# Altium schematic sheet Power.SchDoc
size A3
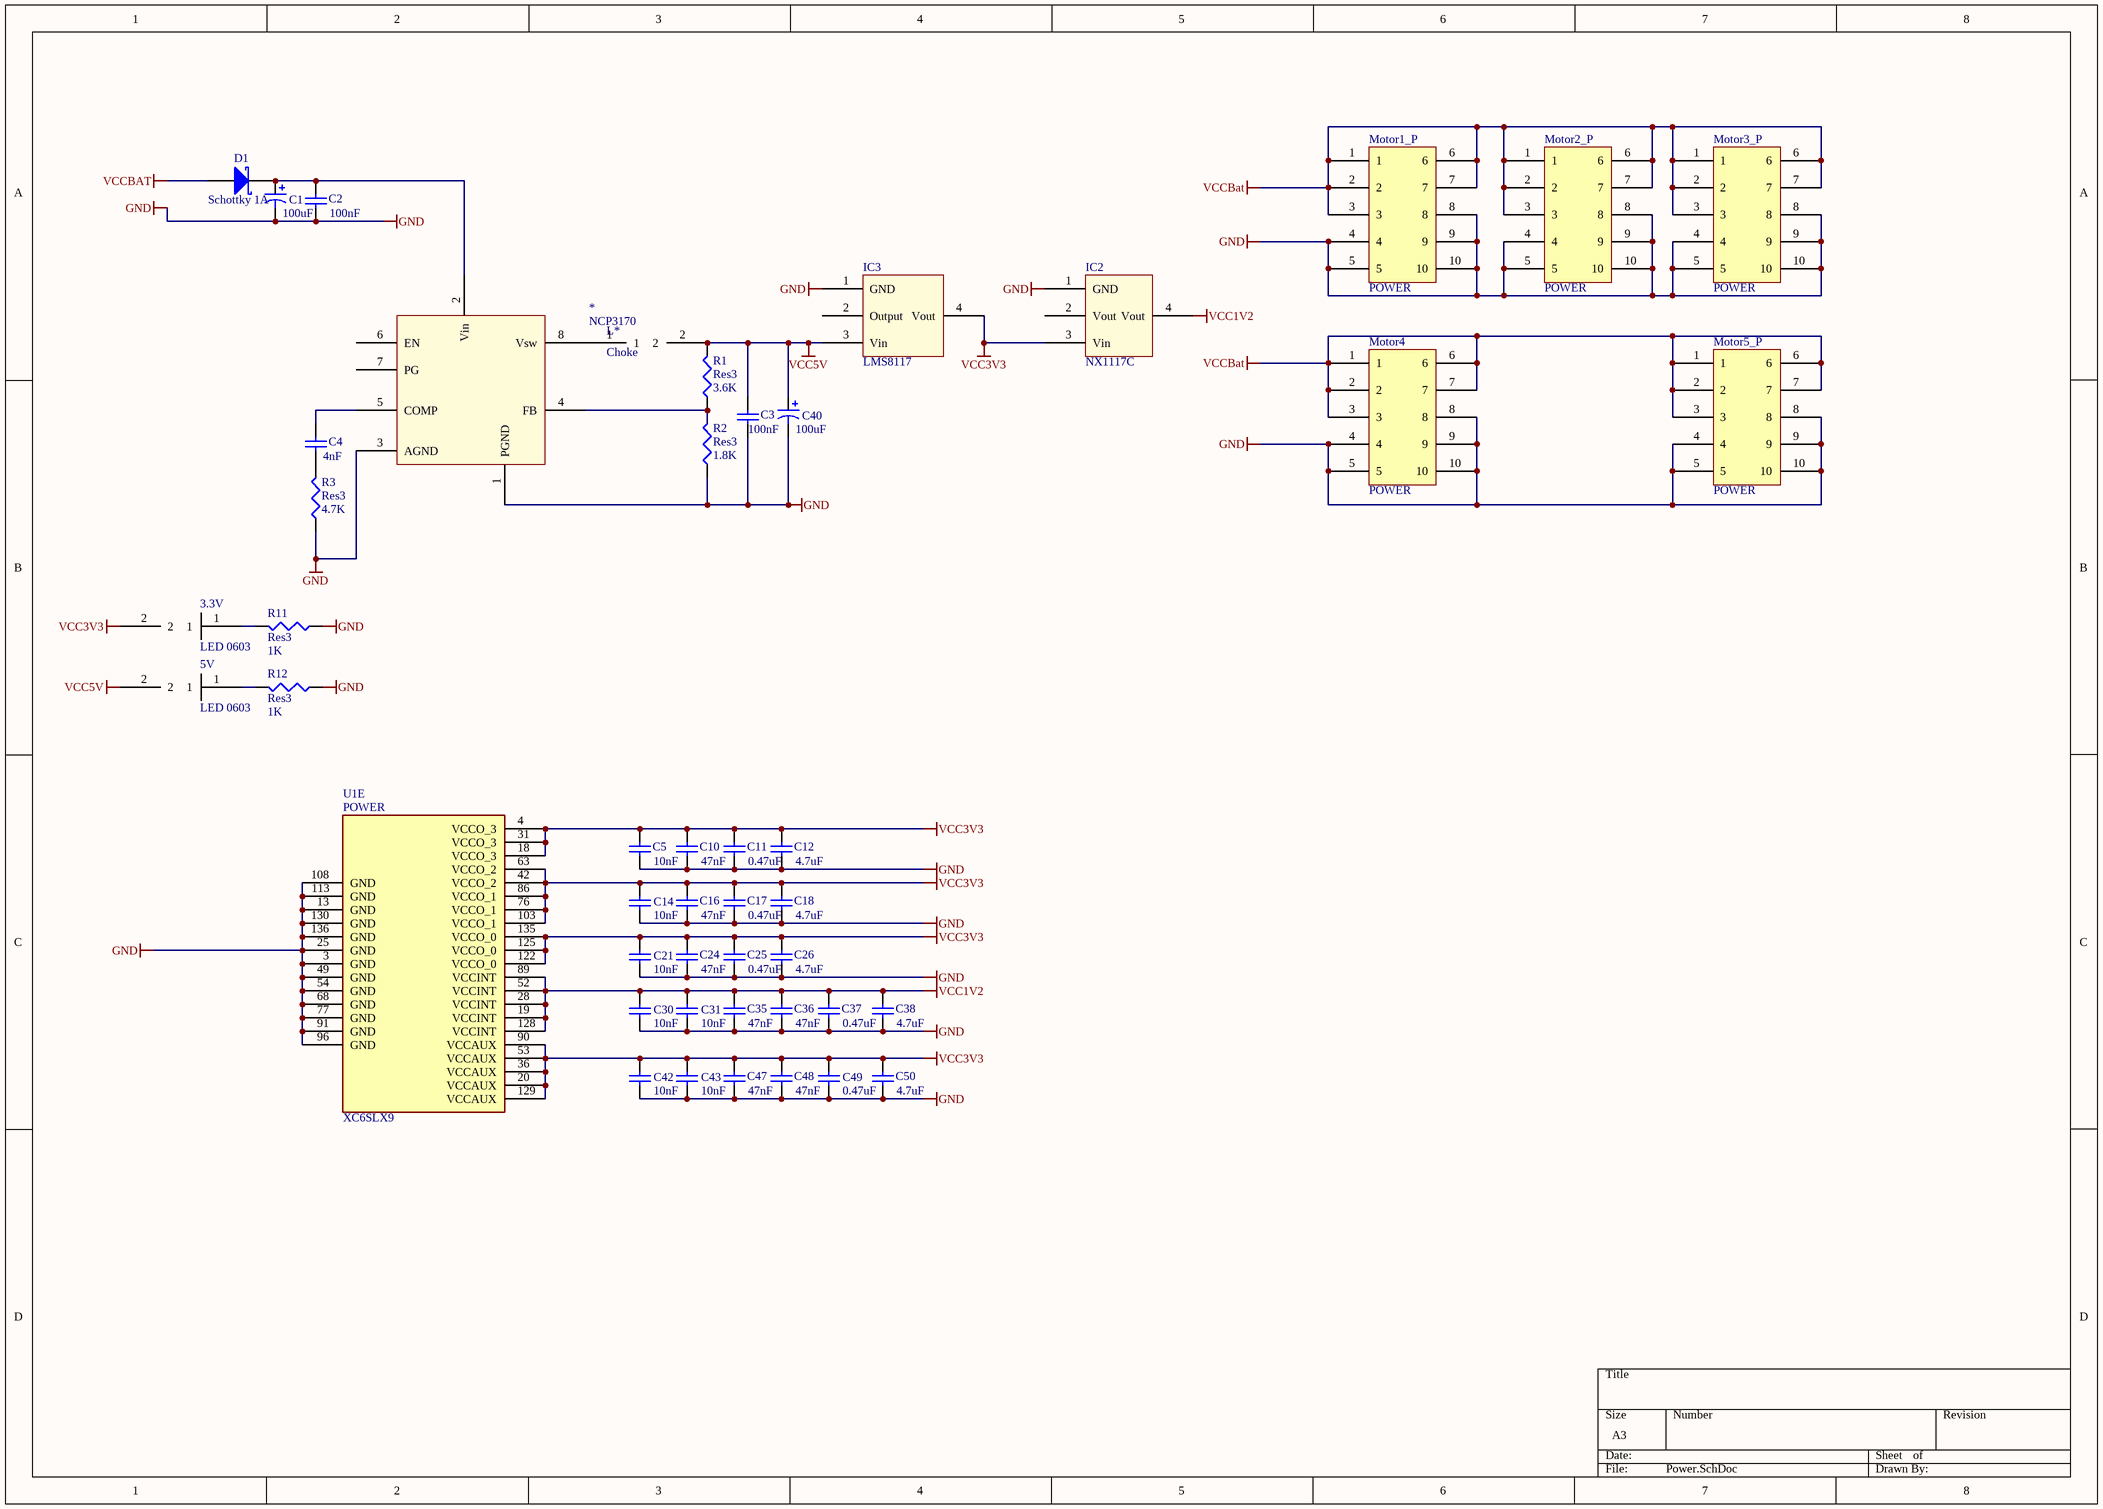
[diagram p0: Power.SchDoc]

## Parts
3.3V  LED 0603  [LED]
5V  LED 0603  [LED]
*  NCP3170  [NCP3170]
C1  value 100uF  [Capacitor]  (hidden comment: Cap Pol1)
C2  value 100nF  [1608[0603]]  (hidden comment: Cap Semi)
C3  value 100nF  [1608[0603]]  (hidden comment: Cap Semi)
C4  value 4nF  [1608[0603]]  (hidden comment: Cap Semi)
C5  value 10nF  [1608[0603]]  (hidden comment: Cap Semi)
C10  value 47nF  [1608[0603]]  (hidden comment: Cap Semi)
C11  value 0.47uF  [1608[0603]]  (hidden comment: Cap Semi)
C12  value 4.7uF  [1608[0603]]  (hidden comment: Cap Semi)
C14  value 10nF  [1608[0603]]  (hidden comment: Cap Semi)
C16  value 47nF  [1608[0603]]  (hidden comment: Cap Semi)
C17  value 0.47uF  [1608[0603]]  (hidden comment: Cap Semi)
C18  value 4.7uF  [1608[0603]]  (hidden comment: Cap Semi)
C21  value 10nF  [1608[0603]]  (hidden comment: Cap Semi)
C24  value 47nF  [1608[0603]]  (hidden comment: Cap Semi)
C25  value 0.47uF  [1608[0603]]  (hidden comment: Cap Semi)
C26  value 4.7uF  [1608[0603]]  (hidden comment: Cap Semi)
C30  value 10nF  [1608[0603]]  (hidden comment: Cap Semi)
C31  value 10nF  [1608[0603]]  (hidden comment: Cap Semi)
C35  value 47nF  [1608[0603]]  (hidden comment: Cap Semi)
C36  value 47nF  [1608[0603]]  (hidden comment: Cap Semi)
C37  value 0.47uF  [1608[0603]]  (hidden comment: Cap Semi)
C38  value 4.7uF  [1608[0603]]  (hidden comment: Cap Semi)
C40  value 100uF  [Capacitor]  (hidden comment: Cap Pol1)
C42  value 10nF  [1608[0603]]  (hidden comment: Cap Semi)
C43  value 10nF  [1608[0603]]  (hidden comment: Cap Semi)
C47  value 47nF  [1608[0603]]  (hidden comment: Cap Semi)
C48  value 47nF  [1608[0603]]  (hidden comment: Cap Semi)
C49  value 0.47uF  [1608[0603]]  (hidden comment: Cap Semi)
C50  value 4.7uF  [1608[0603]]  (hidden comment: Cap Semi)
D1  Schottky 1A  [SMB]
IC2  NX1117C  [NX1117C]
IC3  LMS8117  [LMS8117]
L*  Choke  [Choke]
Motor1_P  POWER  [uMatch10x]
Motor2_P  POWER  [uMatch10x]
Motor3_P  POWER  [uMatch10x]
Motor4  POWER  [uMatch10x]
Motor5_P  POWER  [uMatch10x]
R1  Res3  value 3.6K  [J1-0603]
R2  Res3  value 1.8K  [J1-0603]
R3  Res3  value 4.7K  [J1-0603]
R11  Res3  value 1K  [J1-0603]
R12  Res3  value 1K  [J1-0603]
U1  XC6SLX9  [XC6SLX9]  (part E of 6)

## Nets
GND: *.1(PGND) *.3(AGND) C1.2 C2.1 C3.1 C5.1 C10.1 C11.1 C12.1 C14.1 C16.1 C17.1 C18.1 C21.1 C24.1 C25.1 C26.1 C30.1 C31.1 C35.1 C36.1 C37.1 C38.1 C40.2 C42.1 C43.1 C47.1 C48.1 C49.1 C50.1 IC2.1(GND) IC3.1(GND) Motor1_P.4 Motor1_P.5 Motor1_P.8 Motor1_P.9 Motor1_P.10 Motor2_P.4 Motor2_P.5 Motor2_P.8 Motor2_P.9 Motor2_P.10 Motor3_P.4 Motor3_P.5 Motor3_P.8 Motor3_P.9 Motor3_P.10 Motor4.4 Motor4.5 Motor4.8 Motor4.9 Motor4.10 Motor5_P.4 Motor5_P.5 Motor5_P.8 Motor5_P.9 Motor5_P.10 R2.1 R3.1 R11.1 R12.1 U1.3(GND) U1.13(GND) U1.25(GND) U1.49(GND) U1.54(GND) U1.68(GND) U1.77(GND) U1.91(GND) U1.96(GND) U1.108(GND) U1.113(GND) U1.130(GND) U1.136(GND)
VCC1V2: C30.2 C31.2 C35.2 C36.2 C37.2 C38.2 IC2.4(Vout) U1.19(VCCINT) U1.28(VCCINT) U1.52(VCCINT) U1.89(VCCINT) U1.128(VCCINT)
VCC3V3: 3.3V.2 C5.2 C10.2 C11.2 C12.2 C14.2 C16.2 C17.2 C18.2 C21.2 C24.2 C25.2 C26.2 C42.2 C43.2 C47.2 C48.2 C49.2 C50.2 IC2.3(Vin) IC3.4(Vout) U1.4(VCCO_3) U1.18(VCCO_3) U1.20(VCCAUX) U1.31(VCCO_3) U1.36(VCCAUX) U1.42(VCCO_2) U1.53(VCCAUX) U1.63(VCCO_2) U1.76(VCCO_1) U1.86(VCCO_1) U1.90(VCCAUX) U1.103(VCCO_1) U1.122(VCCO_0) U1.125(VCCO_0) U1.129(VCCAUX) U1.135(VCCO_0)
VCC5V: 5V.2 C3.2 C40.1 IC3.3(Vin) L*.2 R1.2
VCCBat: D1.1(A) Motor1_P.1 Motor1_P.2 Motor1_P.3 Motor1_P.6 Motor1_P.7 Motor2_P.1 Motor2_P.2 Motor2_P.3 Motor2_P.6 Motor2_P.7 Motor3_P.1 Motor3_P.2 Motor3_P.3 Motor3_P.6 Motor3_P.7 Motor4.1 Motor4.2 Motor4.3 Motor4.6 Motor4.7 Motor5_P.1 Motor5_P.2 Motor5_P.3 Motor5_P.6 Motor5_P.7
Net3.3V_1: 3.3V.1 R11.2
Net5V_1: 5V.1 R12.2
Net*_2: *.2(Vin) C1.1 C2.2 D1.2(K)
Net*_4: *.4(FB) R1.1 R2.2
Net*_5: *.5(COMP) C4.2
Net*_8: *.8(Vsw) L*.1
NetC4_1: C4.1 R3.2

Not connected (* = marked no-connect by the designer): * 6(EN) 7(PG); IC2 2(Vout); IC3 2(Output)

## Notes on the sheet
- (in symbol C6SLX9, part E) POWER

## Library data of the parts
C1 C40 = Cap Pol1: Polarized Capacitor (Radial); Published: 8-Jun-2000; LatestRevisionDate: 17-Jul-2002; LatestRevisionNote: Re-released for DXP Platform.; PackageReference: RB7.6-15; Publisher: Altium Limited; PackageDescription: Polarized Capacitor (Radial); 2 Leads; Farnell: http://ee.farnell.com/multicomp/mcgpr35v107m8x11/cap-alu-elect-100uf-35v-can/dp/9451285
C2-C5 C10-C12 C14 C16-C18 C21 C24-C26 C30 C31 C35-C38 C42 C43 C47-C50 = Cap Semi: Capacitor (Semiconductor SIM Model); Published: 8-Jun-2000; LatestRevisionDate: 29-May-2009; LatestRevisionNote: IPC-7351 Footprint Added.; PackageReference: C1206; Publisher: Altium Limited; PackageDescription: Chip Capacitor
D1 = D Schottky: Schottky Diode; Published: 8-Jun-2000; LatestRevisionDate: 17-Jul-2002; LatestRevisionNote: Re-released for DXP Platform.; PackageReference: SMB; Publisher: Altium Limited; PackageDescription: DO-214-AA/SMB; 2 C-Bend Leads; Body 5.3 x 3.6 mm, inc. leads (LxW); Code_JEDEC: DO-214-AA; Farnell: http://ee.farnell.com/multicomp/ss110b/diode-schottky-rectif-1a-100v-smb/dp/1861422
Motor1_P Motor2_P Motor3_P Motor4 Motor5_P = uMatch 10x
R1-R3 R11 R12 = Res3: Resistor; Published: 8-Jun-2000; LatestRevisionDate: 29-May-2009; LatestRevisionNote: IPC-7351 Footprint Added.; PackageReference: J1-0603; Publisher: Altium Limited; PackageDescription: Chip Resistor
U1 = C6SLX9: Imported
L* = Choke: Farnell: http://ee.farnell.com/wurth-elektronik/7440700047/choke-smd-4-7uh-3a/dp/1635879?Ntt=1635879